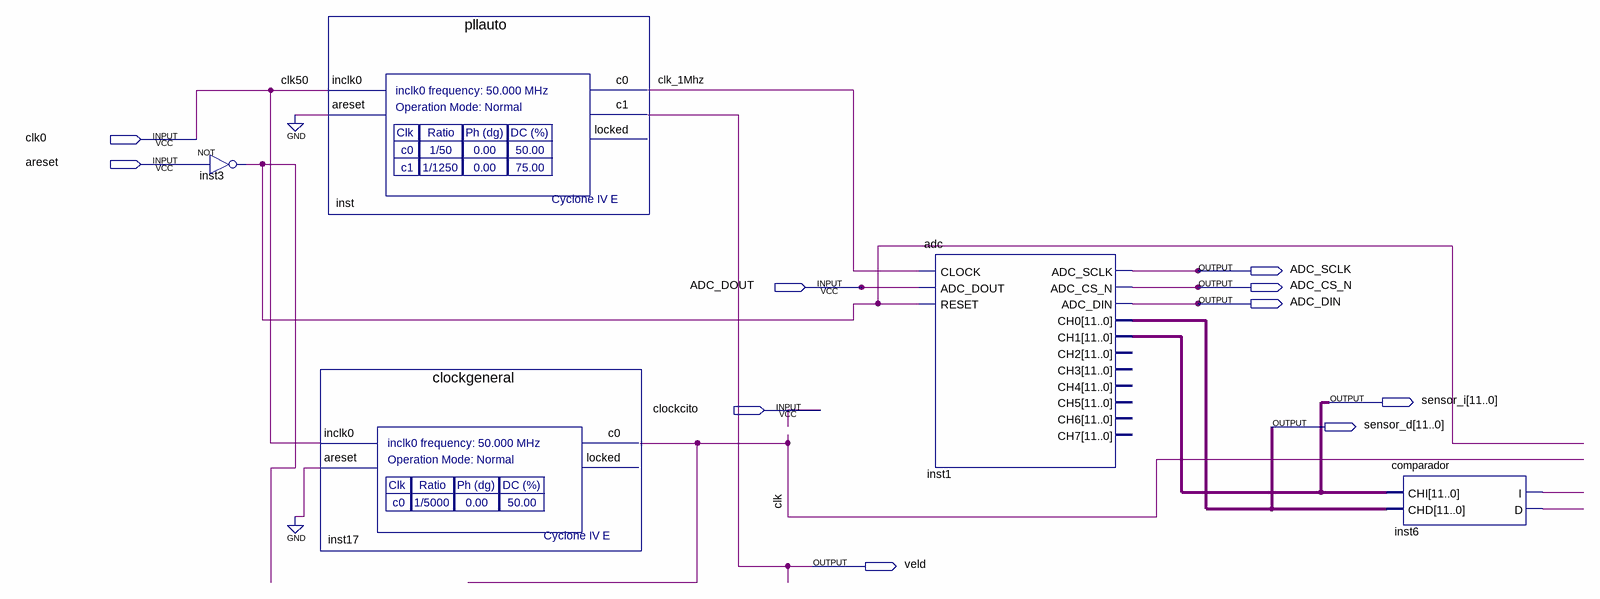
[diagram p0: schematic sheet]
// Quartus schematic prueba_sensores.bdf as structural Verilog: 5 symbols, 10 pins
module prueba_sensores (
  input  clk0,
  input  areset,
  input  ADC_DOUT,
  input  clockcito,
  output ADC_SCLK,
  output ADC_CS_N,
  output ADC_DIN,
  output [11:0] sensor_i,
  output [11:0] sensor_d,
  output veld
);

  wire clk, clk_1Mhz, inst3_out, inst6_d, inst6_i;

  not inst3 (inst3_out, areset);
  pllauto inst (.inclk0(clk0), .areset(1'b0), .c0(clk_1Mhz), .c1(veld));  // open: locked
  clockgeneral inst17 (.inclk0(clk0), .areset(1'b0), .c0(clk));  // open: locked
  adc inst1 (
    .CLOCK(clk_1Mhz), .ADC_DOUT(ADC_DOUT), .RESET(inst3_out), .ADC_SCLK(ADC_SCLK), .ADC_CS_N(ADC_CS_N),
    .ADC_DIN(ADC_DIN), .CH0(sensor_d), .CH1(sensor_i));  // open: CH2, CH3, CH4, CH5, CH6, CH7
  comparador inst6 (.CHI(sensor_i), .CHD(sensor_d), .I(inst6_i), .D(inst6_d));

  // Other names for the same wires on the sheet: clk50 = clk0
endmodule
